# Altium schematic sheet Wah PCB.SchDoc
size A; SheetNumber: 1; SheetTotal: 1
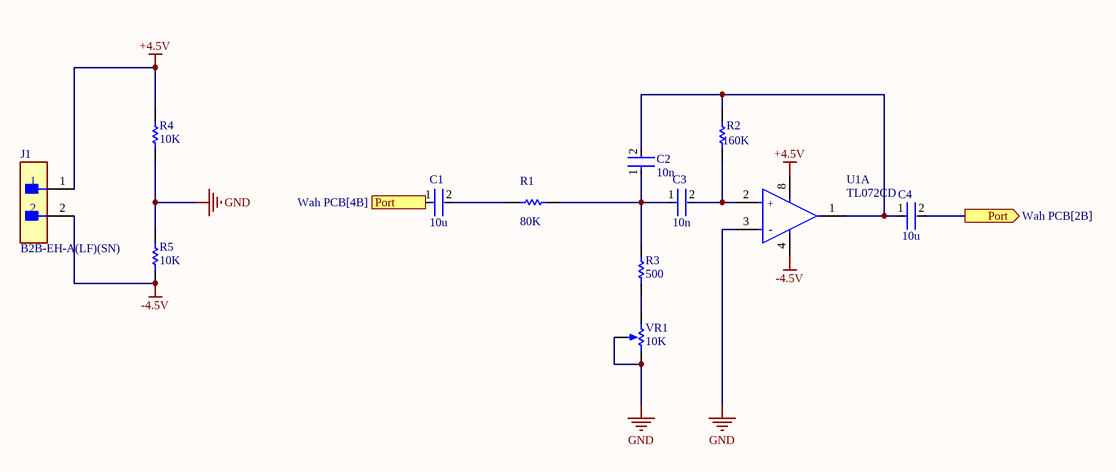
[diagram p0: Wah PCB.SchDoc]

## Parts
C1  10u  [FP-F471K33Y5RP6UK5R-MFG]
C2  10n  [FP-F471K33Y5RP6UK5R-MFG]
C3  10n  [FP-F471K33Y5RP6UK5R-MFG]
C4  10u  [FP-F471K33Y5RP6UK5R-MFG]
J1  B2B-EH-A(LF)(SN)  [FP-B2B-EH-A_LF_SN-MFG]
R1  80K  [RESA60-630X240]
R2  160K  [RESA60-630X240]
R3  500  [RESA60-630X240]
R4  10K  [RESA60-630X240]
R5  10K  [RESA60-630X240]
U1  TL072CD  [FP-SO8-IPC_C]  (part A of 2)
VR1  10K  [BOUR-3852A-282-103AL-3_V]

## Ports
Port (in, see Wah PCB[4B]), Port (out, see Wah PCB[2B])

## Nets
+4.5V: J1.1 R4.2 U1.8(VCC+)
-4.5V: J1.2 R5.1 U1.4(VCC-)
GND: R4.1 R5.2 U1.3(Non-inverting_input_1) VR1.2(S) VR1.3(CW)
Port: C1.1 C4.2 ; port Port
NetC1_2: C1.2 R1.1
NetC2_1: C2.1 C3.1 R1.2 R3.2
NetC2_2: C2.2 C4.1 R2.2 U1.1(Output_1)
NetC3_2: C3.2 R2.1 U1.2(Inverting_input_1)
NetR3_1: R3.1 VR1.1(CCW)

## Notes on the sheet
- (in symbol CMP-12131-000015-1, part A) +

## Library data of the parts
C1-C4 = CMP-02417-000080-1: CAP CER 470PF 2KV Y5R RADIAL; Tolerance: 10%; Dielectric Material: Ceramic; Insulation Resistance: 10GR; Lead/Base Style: Kinked; Lead Diameter: 0.8mm; Series: F; Depth: 5mm; Package Quantity: 1500; Resistor Type: Ceramic; Construction: RADIAL; Min Operating Temperature: -30°C; Mount: Through Hole; Radiation Hardening: No; Voltage: 2kV; Voltage Rating: 2kV; Max Operating Temperature: 125°C; Termination: Radial; RoHS Compliant: Yes; Lead Pitch: 5mm; Capacitance: 470pF; Packaging: Tape and Reel; Length: 8.5mm; Case/Package: Radial; Dielectric: Y5R
J1 = CMP-17439-000026-1: CONN HEADER VERT 2POS 2.5MM; Number of Contacts: 2; Current Rating: 3A; Connector Type: Plug; Contact Resistance: 20mR; Gender: Male; Voltage Rating: 250V; Fastening Type: Detent; Depth: 3.8mm; Max Operating Temperature: 85°C; Orientation: Straight; Series: EH; Contact Plating: Tin; Min Operating Temperature: -25°C; Contact Type: Male Pin; Housing Color: White; Termination: Press-Fit; Housing Material: Nylon; Pitch: 2.5mm; Number of Positions: 2; Max Current Rating: 3A; Packaging: Bulk; Lead Free: Lead Free; Number of Rows: 1; Length: 7.5mm; Contact Mating Length: 0.13inch; Color: Natural; Max Voltage Rating (AC): 250V; Contact Material: Copper Alloy; Mount: Through Hole
R1-R5 = CMP-1659-00067-1: Axial Resistor, 47.5 Ohm, +/- 1%, 0.25 W, -55 to 155 degC, 2-Pin THD, RoHS, Bulk; Nominal Voltage Gain: 100 dB; Slew Rate: 1 V\us; Common Mode Rejection Ratio: 50 dB; Bandwidth: 1 MHz; Min Supply Voltage: 3 V; Case\Package: SOIC; Output Current: 160 mA; Channels: 4; Max Supply Voltage: 5 V; Nominal Supply Current: 170 uA; Packaging: Tape and Reel; Pins: 14; ComponentLink1URL: http://www.yageo.com/; RoHSCompliant: true; Radiation Hardening: No; Width: 3.91 mm; ComponentLink2Description: Datasheet; PackageReference: MFR-25; Length: 8.65 mm; ComponentLink1Description: Manufacturer URL; Mount: Surface Mount; Nominal Gain Bandwith Product: 1 MHz; DatasheetVersion: Apr-13; Unity Gain Bandwidth Product: 1 MHz; Min Operating Temperature: -40 degC; Max Operating Temperature: 85 degC; PackageDescription: 2-Pin Axial Lead, Dia 2.4 mm, Body Length 6.3 mm; ComponentLink2URL: http://www.yageo.com/documents/recent/Yageo%20LR_MFR_2013.pdf; Package Quantity: 2500; Height: 1.58 mm; REACH SVHC: No SVHC
U1 = CMP-12131-000015-1: IC OPAMP JFET 2 CIRCUIT 8SO; Unity Gain Bandwidth Product: 4MHz; Max Supply Voltage: 36V; Max Dual Supply Voltage: 18V; Voltage Gain: 106.02dB; Output Current: 40mA; Input Offset Voltage (Vos): 10mV; Slew Rate-Nom: 13V/µs; Min Input Voltage: -12V; Number of Channels: 2; Common Mode Rejection Ratio: 70dB; Dual Supply Voltage: 15V; Supply Current: 2.5mA; Input Offset Voltage-Max: 3mV; Slew Rate: 16V/µs; Min Dual Supply Voltage: 3V; Amplifier Type: LOW NOISE; Operating Supply Current: 1.4mA; Input Bias Current: 200pA; Height: 1.25mm; REACH SVHC: No SVHC; Lead Free: Lead Free; Series: -; Width: 4mm; Packaging: Rail/Tube; Max Operating Temperature: 70°C; Length: 5mm; Number of Amplifiers: 2; Number of Elements: 2; Gain Bandwidth Product: 4MHz; Operating Supply Voltage: 18V; Number of Pins: 8; Case/Package: SO; Mount: Surface Mount; Max Input Voltage: 15V; Number of Circuits: 2; Radiation Hardening: No; Min Operating Temperature: 0°C; Nominal Supply Current: 2.5mA; Technology: BIFET; Output Current per Channel: 40mA; Package Quantity: 100; RoHS Compliant: Yes
VR1 = CMP-2000-05079-1: Diameter Panel Control, 10 KOhm, +/- 10%, 2 W, -1 to 125 degC, 3-Pin THD, RoHS, Bulk; Manufacturer: Bourns; Temperature Coefficient: ±150ppm/degC; Number of Gangs: 1; Other Names: 3852A282103AL; Actuator Length: 0.875"(22.23mm); Resistive Material: Cermet; PCN Design/Specification: PBTResinJun/2011; Rotation: 280deg; PCN Other: MultipleChanges01/Dec/2012; Catalog Drawings: 3852SeriesSide1 / 3852SeriesSide2; Online Catalog: 3852and3856Series; Associated Product: 36-8560-ND / -KNOBINSTRUMW/DIALRND.9"DIA / 36-8555-ND / -KNOBINSTRUMSKIRTEDRND.7"DIA / 36-8556-ND / -KNOBINSTRUMSKIRTEDRND.9"DIA / 36-8565-ND / -KNOBINSTRUMDBLBARRND.7"DIA / 36-8566-ND / -KNOBINSTRUMDBLBARRND.9"DIA / 36-8568-ND / -KNOBINSTRUMSGLBARRND.7"DIA / 36-8569-ND / -KNOBINSTRUMSGLBARRND.9"DIA / 36-8559-ND / -KNOBINSTRUMW/DIALRND.7"DIA / 226-1006-ND / -KNOBBLKGLOSS.75"DIA.250"SHAFT / 226-1007-ND / -KNOBBLKGLOSS.925"DIA.250"SHAFT / 226-1011-ND / -KNOBBLKGLOS; Actuator Diameter: 0.250"(6.35mm); Built in Switch: None; Power (Watts): 2W; Actuator Type: Slotted; Standard Package: 45; Tolerance: ±10%; Taper: Linear; Series: 3852; Packaging: Bulk; Category: Potentiometers,VariableResistors; Bushing Thread: 3/8-32; Datasheet URL: https://datasheet.ciiva.com/11831/0900766b80f93b4b-11831016.pdf; Datasheet Version: Sep-14; Number of Turns: 1; Family: RotaryPotentiometers,Rheostats; Termination Style: SolderLug; Resistance (Ohms): 10k; RoHS Information: 3852A-LMaterialDeclaration; Mounting Type: PanelMount; Manufacturer URL: http://www.bourns.com/